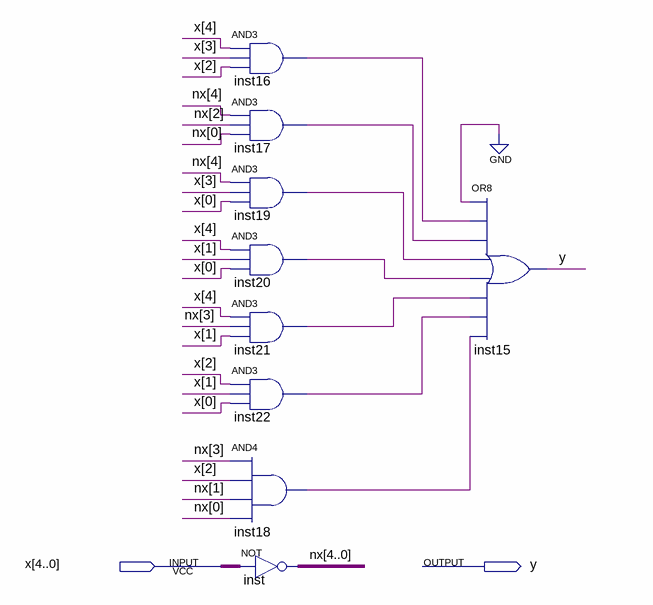
[diagram p0: schematic sheet]
// Quartus schematic lab2.bdf as structural Verilog: 9 symbols, 2 pins
module lab2 (
  input  [4:0] x,
  output y
);

  wire inst16_out, inst17_out, inst18_out, inst19_out, inst20_out, inst21_out, inst22_out;
  wire [4:0] nx;

  and inst16 (inst16_out, x[4], x[3], x[2]);
  and inst17 (inst17_out, nx[4], nx[2], nx[0]);
  and inst19 (inst19_out, nx[4], x[3], x[0]);
  and inst20 (inst20_out, x[4], x[1], x[0]);
  and inst21 (inst21_out, x[4], nx[3], x[1]);
  and inst22 (inst22_out, x[2], x[1], x[0]);
  and inst18 (inst18_out, nx[3], x[2], nx[1], nx[0]);
  assign nx = ~x;  // NOT inst, 5 bits wide
  or inst15 (y, 1'b0, inst16_out, inst17_out, inst19_out, inst20_out, inst21_out, inst22_out, inst18_out);
endmodule
